# Altium schematic sheet TTAmp_3T0K_amp_tensometer_2.SchDoc
size A4; ApprovedBy: Krzysztof Belewicz; CheckedBy: Krzysztof Belewicz; Author: Krzysztof Belewicz; CompanyName: Koło Naukowe Systemów Scalonych; DrawnBy: Krzysztof Belewicz; Organization: KNSS; Address1: Koło Naukowe; Address2: Systemów Scalonych; Address3: 00-665 Warszawa; Address4: Nowowiejska 15/19; Revision: 0.1; SheetNumber: 3; SheetTotal: 5
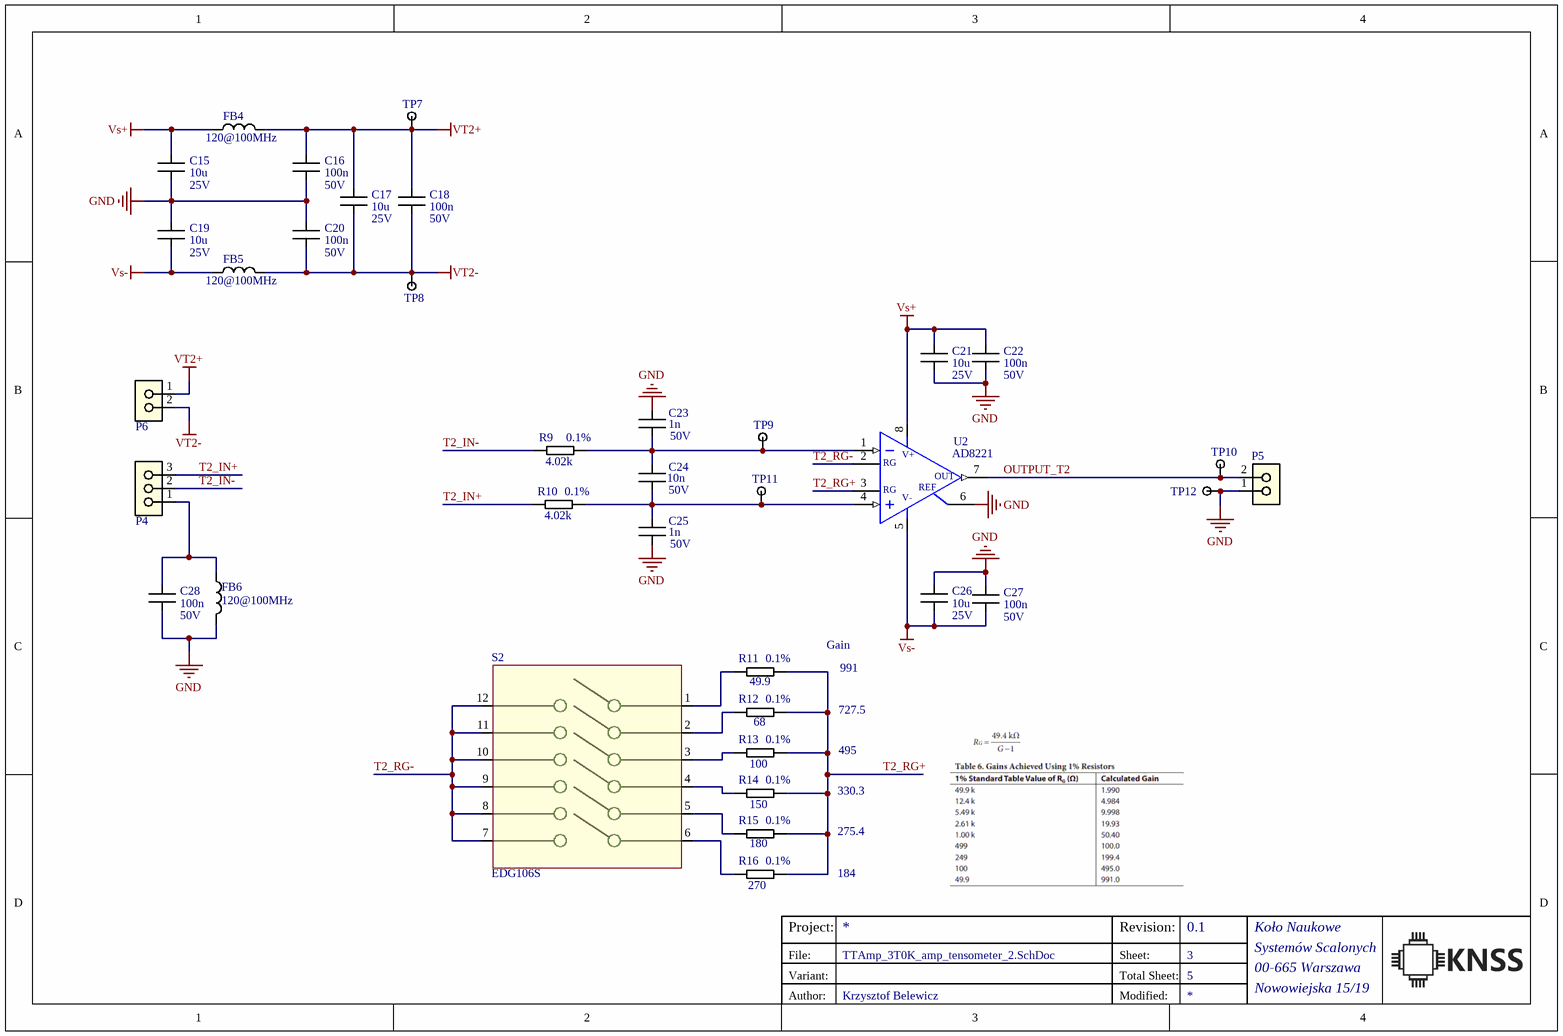
[diagram p0: TTAmp_3T0K_amp_tensometer_2.SchDoc]

## Parts
C15  value 10u  MaxVoltage: 25V  [CAPC2012N]  (hidden comment: Capacitor)
C16  value 100n  MaxVoltage: 50V  [CAPC1608N]  (hidden comment: Capacitor)
C17  value 10u  MaxVoltage: 25V  [CAPC2012N]  (hidden comment: Capacitor)
C18  value 100n  MaxVoltage: 50V  [CAPC1608N]  (hidden comment: Capacitor)
C19  value 10u  MaxVoltage: 25V  [CAPC2012N]  (hidden comment: Capacitor)
C20  value 100n  MaxVoltage: 50V  [CAPC1608N]  (hidden comment: Capacitor)
C21  value 10u  MaxVoltage: 25V  [CAPC2012N]  (hidden comment: Capacitor)
C22  value 100n  MaxVoltage: 50V  [CAPC1608N]  (hidden comment: Capacitor)
C23  value 1n  MaxVoltage: 50V  [CAPC1608N]  (hidden comment: Capacitor)
C24  value 10n  MaxVoltage: 50V  [CAPC1608N]  (hidden comment: Capacitor)
C25  value 1n  MaxVoltage: 50V  [CAPC1608N]  (hidden comment: Capacitor)
C26  value 10u  MaxVoltage: 25V  [CAPC2012N]  (hidden comment: Capacitor)
C27  value 100n  MaxVoltage: 50V  [CAPC1608N]  (hidden comment: Capacitor)
C28  value 100n  MaxVoltage: 50V  [CAPC1608N]  (hidden comment: Capacitor)
FB4  value 120@100MHz  [INDC1608N]  (hidden comment: Ferrite Bead)
FB5  value 120@100MHz  [INDC1608N]  (hidden comment: Ferrite Bead)
FB6  value 120@100MHz  [INDC1608N]  (hidden comment: Ferrite Bead)
P4  AK100/3DS-5,0-V/GRAU  [AK100/3DS-5,0-V/GRAU]  (value not drawn)
P5  AK100/2DS-5,0-V/GRAU  [AK100/2DS-5,0-V/GRAU]  (value not drawn)
P6  AK100/2DS-5,0-V/GRAU  [AK100/2DS-5,0-V/GRAU]  (value not drawn)
R9  value 4.02k  Tolerance: 0.1%  [RESC1608N]  (hidden comment: Resistor)
R10  value 4.02k  Tolerance: 0.1%  [RESC1608N]  (hidden comment: Resistor)
R11  value 49.9  Tolerance: 0.1%  [RESC1608N]  (hidden comment: Resistor)
R12  value 68  Tolerance: 0.1%  [RESC1608N]  (hidden comment: Resistor)
R13  value 100  Tolerance: 0.1%  [RESC1608N]  (hidden comment: Resistor)
R14  value 150  Tolerance: 0.1%  [RESC1608N]  (hidden comment: Resistor)
R15  value 180  Tolerance: 0.1%  [RESC1608N]  (hidden comment: Resistor)
R16  value 270  Tolerance: 0.1%  [RESC1608N]  (hidden comment: Resistor)
S2  EDG106S  [EDG106S]
TP7  (no value)  [TP-SMD-1.0MM]  (no BOM)
TP8  (no value)  [TP-SMD-1.0MM]  (no BOM)
TP9  (no value)  [TP-SMD-1.0MM]  (no BOM)
TP10  (no value)  [TP-SMD-1.0MM]  (no BOM)
TP11  (no value)  [TP-SMD-1.0MM]  (no BOM)
TP12  (no value)  [TP-SMD-1.0MM]  (no BOM)
U2  AD8221  [R-8_N]

## Nets
GND: C15.1 C16.1 C19.2 C20.2 C21.1 C22.1 C23.2 C25.1 C26.2 C27.2 C28.1 FB6.2 P5.1 TP12.1 U2.6(REF)
Vs+: C15.2 C21.2 C22.2 FB4.2 U2.8(V+)
Vs-: C19.1 C26.1 C27.1 FB5.2 U2.5(V-)
VT2+: C16.2 C17.2 C18.2 FB4.1 P6.1 TP7.1
VT2-: C17.1 C18.1 C20.1 FB5.1 P6.2 TP8.1
OUTPUT_T2: P5.2 TP10.1 U2.7(OUT)
T2_IN+: P4.3 R10.2
T2_IN-: P4.2 R9.2
T2_RG+: R11.1 R12.1 R13.1 R14.1 R15.1 R16.1 U2.3(RG)
T2_RG-: S2.7 S2.8 S2.9 S2.10 S2.11 S2.12 U2.2(RG)
NetC23_1: C23.1 C24.2 R9.1 TP9.1 U2.1(-IN)
NetC24_1: C24.1 C25.2 R10.1 TP11.1 U2.4(+IN)
NetC28_2: C28.2 FB6.1 P4.1
NetR11_2: R11.2 S2.1
NetR12_2: R12.2 S2.2
NetR13_2: R13.2 S2.3
NetR14_2: R14.2 S2.4
NetR15_2: R15.2 S2.5
NetR16_2: R16.2 S2.6

## Notes on the sheet
- Gain
- 727.5
- 991
- 495
- 330.3
- 275.4
- 184
- Project:
- Variant:
- File:
- Sheet:
- Revision:
- Total Sheet:
- Author:
- Modified:

## Library data of the parts
C15-C23 C25-C28 = Capacitor: Tolerance: 10%; Supplier 1: TME; Supplier 2: *
  C15 C17 C19 C21 C26: Supplier Part Number 1: GRM21BR61E106KA73L
  C16 C18 C20 C22 C27 C28: Supplier Part Number 1: CL10B104KB8NNNC
  C23 C25: Supplier Part Number 1: VJ0603Y102KXACW1BC
C24 = Capacitor: Tolerance: 20%; Supplier 1: TME; Supplier 2: *; Supplier Part Number 1: VJ0603Y103MXACW1BC
FB4-FB6 = Inductor: Max Current: 3A; Tolerance: *; Supplier 1: TME; Supplier 2: *; Supplier Part Number 1: BLM18KG121TN1D
P4 = AK100/3DS-5,0-V/GRAU: Listwa zaciskowa do druku; kątowe 90°; 5mm; tory:3; na PCB; 24A; Manufacturer: PTR MESSTECHNIK; Supplier Part Number 1: TB-5.0-P-3P-12; Supplier 1: TME; Manufacturer Part Number: AK100/3DS-5,0-V/GRAU
P5 P6 = AK100/2DS-5,0-V/GRAU: Listwa zaciskowa do druku; kątowe 90°; 5mm; tory:2; na PCB; 24A; Manufacturer: PTR MESSTECHNIK; Supplier Part Number 1: TB-5.0-P-2P-12; Supplier 1: TME; Manufacturer Part Number: AK100/2DS-5,0-V/GRAU
R9 R10 = Resistor: Manufacturer Part Number 1: AR03BTCX4021; Manufacturer 1: VIKING; Power: 0.1W; Supplier 1: TME; Supplier Part Number 1: AR0603-4K02-0.1%
R11 = Resistor: Manufacturer 1: VIKING; Manufacturer Part Number 1: AR03BTCX49R9; Power: 0.1W; Supplier 1: TME; Supplier Part Number 1: AR0603-49R9-0.1%
R12 = Resistor: Manufacturer Part Number 1: AR03BTCX0680; Manufacturer: VIKING; Power: 0.1W; Supplier 1: TME; Supplier Part Number 1: AR0603-68R-0.1%
R13 = Resistor: Manufacturer Part Number 1: AR03BTCX1000; Manufacturer 1: VIKING; Power: 0.1W; Supplier 1: TME; Supplier Part Number 1: AR0603-100R-0.1%
R14 = Resistor: Manufacturer Part Number 1: AR03BTCX1500; Manufacturer 1: VIKING; Power: 0.1W; Supplier 1: TME; Supplier Part Number 1: AR0603-150R-0.1%
R15 = Resistor: Manufacturer Part Number 1: AR03BTCX1800; Manufacturer 1: VIKING; Power: 0.1W; Supplier 1: TME; Supplier Part Number 1: AR0603-180R-0.1%
R16 = Resistor: Manufacturer Part Number 1: AR03BTCX2700; Manufacturer 1: VIKING; Power: 0.1W; Supplier 1: TME; Supplier Part Number 1: AR0603-180R-0.1%
S2 = EDG106S: Przełącznik: DIP-SWITCH; Ilość sekcji:6; ON-OFF; 0,1A/24VDC; 500V; Manufacturer 1: ECE; Manufacturer Part Number 1: EDG106S; Supplier 1: TME; Supplier Part Number 1: EDG106S
TP7-TP12 = TP1: Test Point for probe
U2 = AD8221: Precision Instrumentation Amplifier; Manufacturer Part Number 1: AD8221BRZ; Manufacturer 1: ANALOG DEVICES; PackageReference 1: SOIC_N; ComponentLink1Description: Manufacturer Link; ComponentLink1URL: http://www.analog.com/en/prod/0%2C2877%2CAD622%2C00.html; ComponentLink2Description: Datasheet; ComponentLink2URL: http://www.analog.com/UploadedFiles/Data_Sheets/218546992AD622_c.pdf; Supplier 1: TME; Supplier Part Number 1: AD8221BRZ